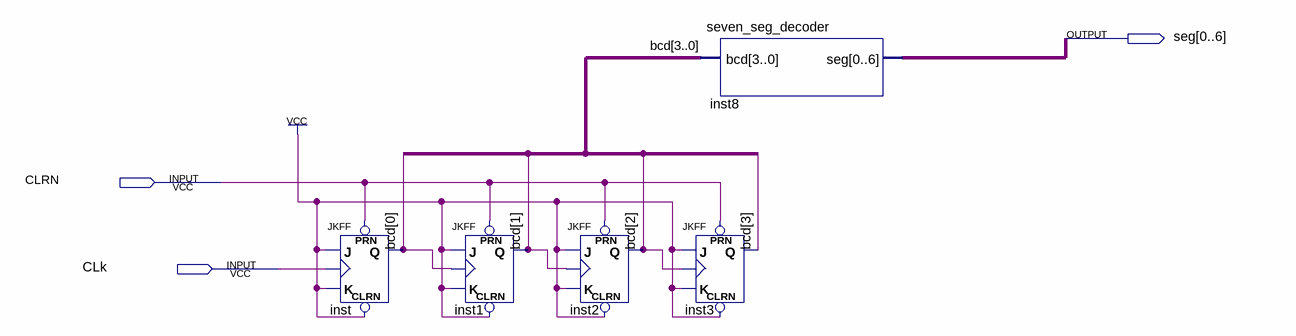
[diagram p0: schematic sheet]
// Quartus schematic lab10step3b.bdf as structural Verilog: 5 symbols, 3 pins
module lab10step3b (
  input  CLRN,
  input  CLk,
  output [0:6] seg
);

  wire [3:0] bcd;

  JKFF inst (.PRN(CLRN), .CLRN(1'b1), .K(1'b1), .J(1'b1), .CLK(CLk), .Q(bcd[0]));
  JKFF inst1 (.PRN(CLRN), .CLRN(1'b1), .K(1'b1), .J(1'b1), .CLK(bcd[0]), .Q(bcd[1]));
  JKFF inst2 (.PRN(CLRN), .CLRN(1'b1), .K(1'b1), .J(1'b1), .CLK(bcd[1]), .Q(bcd[2]));
  seven_seg_decoder inst8 (.bcd(bcd), .seg(seg));
  JKFF inst3 (.PRN(CLRN), .CLRN(1'b1), .K(1'b1), .J(1'b1), .CLK(bcd[2]), .Q(bcd[3]));
endmodule
